# EAGLE design booster013 (EAGLE 4.16)

## Sheet 1 of 2
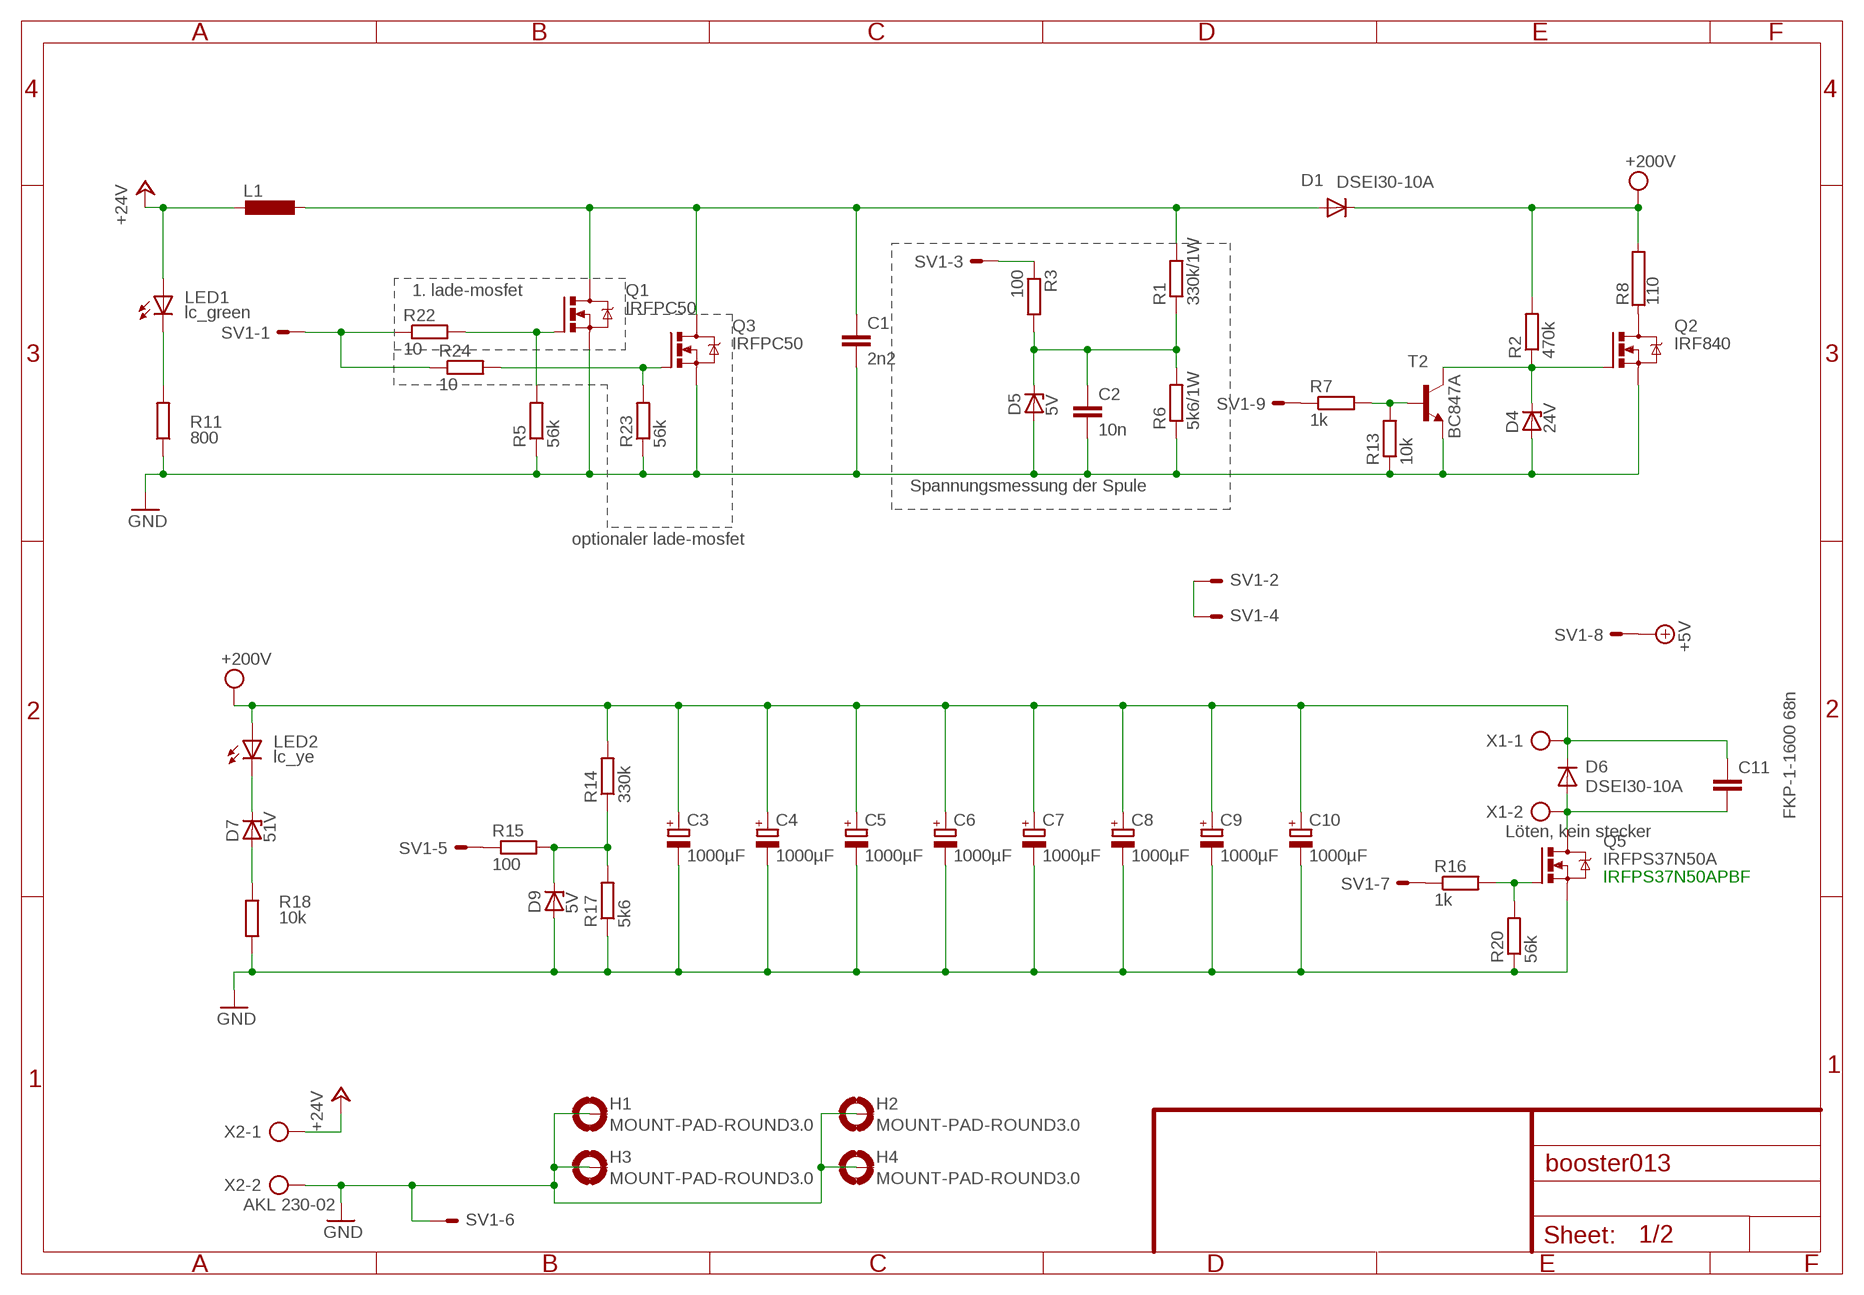
[diagram p0: schematic, sheet 1]

### Parts
C1  2n2  C-EU150-054X183  [C150-054X183]
C2  10n  C-EUC0603  [C0603]
C3  1000µF  CPOL-EUE10-35  [EB35D]
C4  1000µF  CPOL-EUE10-35  [EB35D]
C5  1000µF  CPOL-EUE10-35  [EB35D]
C6  1000µF  CPOL-EUE10-35  [EB35D]
C7  1000µF  CPOL-EUE10-35  [EB35D]
C8  1000µF  CPOL-EUE10-35  [EB35D]
C9  1000µF  CPOL-EUE10-35  [EB35D]
C10  1000µF  CPOL-EUE10-35  [EB35D]
C11  FKP-1-1600 68n  C-EU375-192X418  [C375-192X418]
D1  DSEI30-10A  DEIS10-30A  [TO247AD]
D4  24V  ZENER-DIODEDO35Z10  [DO35Z10]
D5  5V  ZENER-DIODESOT23  [SOT23]
D6  DSEI30-10A  DEIS10-30A  [TO247AD]
D7  51V  ZENER-DIODEDO35Z10  [DO35Z10]
D9  5V  ZENER-DIODESOT23  [SOT23]
H1  MOUNT-PAD-ROUND3.0  [3,0-PAD]
H2  MOUNT-PAD-ROUND3.0  [3,0-PAD]
H3  MOUNT-PAD-ROUND3.0  [3,0-PAD]
H4  MOUNT-PAD-ROUND3.0  [3,0-PAD]
L1  L-EUTJ6-U1  [TJ6-U1]
LED1  lc_green  LED5MM  [LED5MM]
LED2  lc_ye  LED5MM  [LED5MM]
Q1  IRFPC50  IRFPC40  [TO247BV]
Q2  IRF840  IRF740  [TO220BV]
Q3  IRFPC50  IRFPC40  [TO247BV]
Q5  IRFPS37N50A  IRFPC40  [TO247BV]
R1  330k/1W  R-EU_0309/12  [0309/12]
R2  470k  R-EU_R0805  [R0805]
R3  100  R-EU_R0805  [R0805]
R5  56k  R-EU_R0805  [R0805]
R6  5k6/1W  R-EU_0309/12  [0309/12]
R7  1k  R-EU_R0805  [R0805]
R8  110  RHS25  [HS25]
R11  800  R-EU_R0805  [R0805]
R13  10k  R-EU_R0805  [R0805]
R14  330k  R-EU_R0805  [R0805]
R15  100  R-EU_R0805  [R0805]
R16  1k  R-EU_R0805  [R0805]
R17  5k6  R-EU_R0805  [R0805]
R18  10k  R-EU_R0805  [R0805]
R20  56k  R-EU_R0805  [R0805]
R22  10  R-EU_R0805  [R0805]
R23  56k  R-EU_R0805  [R0805]
R24  10  R-EU_R0805  [R0805]
SV1  ML10LE  [ML10L]
T2  BC847A  BC817-25-NPN-SOT23-BEC  [SOT23-BEC]
X1  Löten, kein stecker  AK500/2-H  [AK500/2-H]
X2  AKL 230-02  AK500/2-H  [AK500/2-H]

### Nets
+5V: SV1.8 ; also sheet 2
+24V: L1.2 LED1.A X2.1
ADC_250V: C2.1 D5.3(C) R1.1 R3.2 R6.2
ADC_250V1: D9.3(C) R14.1 R15.2 R17.2
GND [Power]: C1.2 C2.2 C3.- C4.- C5.- C6.- C7.- C8.- C9.- C10.- D4.A D5.1(A) D9.1(A) H1.B3,0(MOUNT) H2.B3,0(MOUNT) H3.B3,0(MOUNT) H4.B3,0(MOUNT) Q1.S Q2.S Q3.S Q5.S R5.1 R6.1 R11.1 R13.1 R17.1 R18.1 R20.1 R23.1 SV1.6 T2.E X2.2 ; also sheet 2
N$2: Q5.G R16.2 R20.2
N$3: D7.A R18.2
N$5: C11.2 D6.A Q5.D X1.2
N$6: D7.C LED2.K(C)
N$7: LED1.K(C) R11.2
N$8: R15.1 SV1.5
N$9: R3.1 SV1.3
N$10: Q2.D R8.1
N$11: R16.1 SV1.7
N$14: R7.1 SV1.9
N$16: SV1.2 SV1.4
N$18: D4.C Q2.G R2.1 T2.C
N$20: R22.1 R24.1 SV1.1
N$21: R7.2 R13.2 T2.B
N$22: Q3.G R23.2 R24.2
N$29: Q1.G R5.2 R22.2
N$32 [Power]: C1.1 D1.A L1.1 Q1.D Q3.D R1.2
VPP: C3.+ C4.+ C5.+ C6.+ C7.+ C8.+ C9.+ C10.+ C11.1 D1.K(C) D6.K(C) LED2.A R2.2 R8.2 R14.2 X1.1 ; supply symbol labelled +200V ; also sheet 2

### Notes on the sheet
- 1. lade-mosfet
- Spannungsmessung der Spule
- optionaler lade-mosfet
- IRFPS37N50APBF

## Sheet 2 of 2
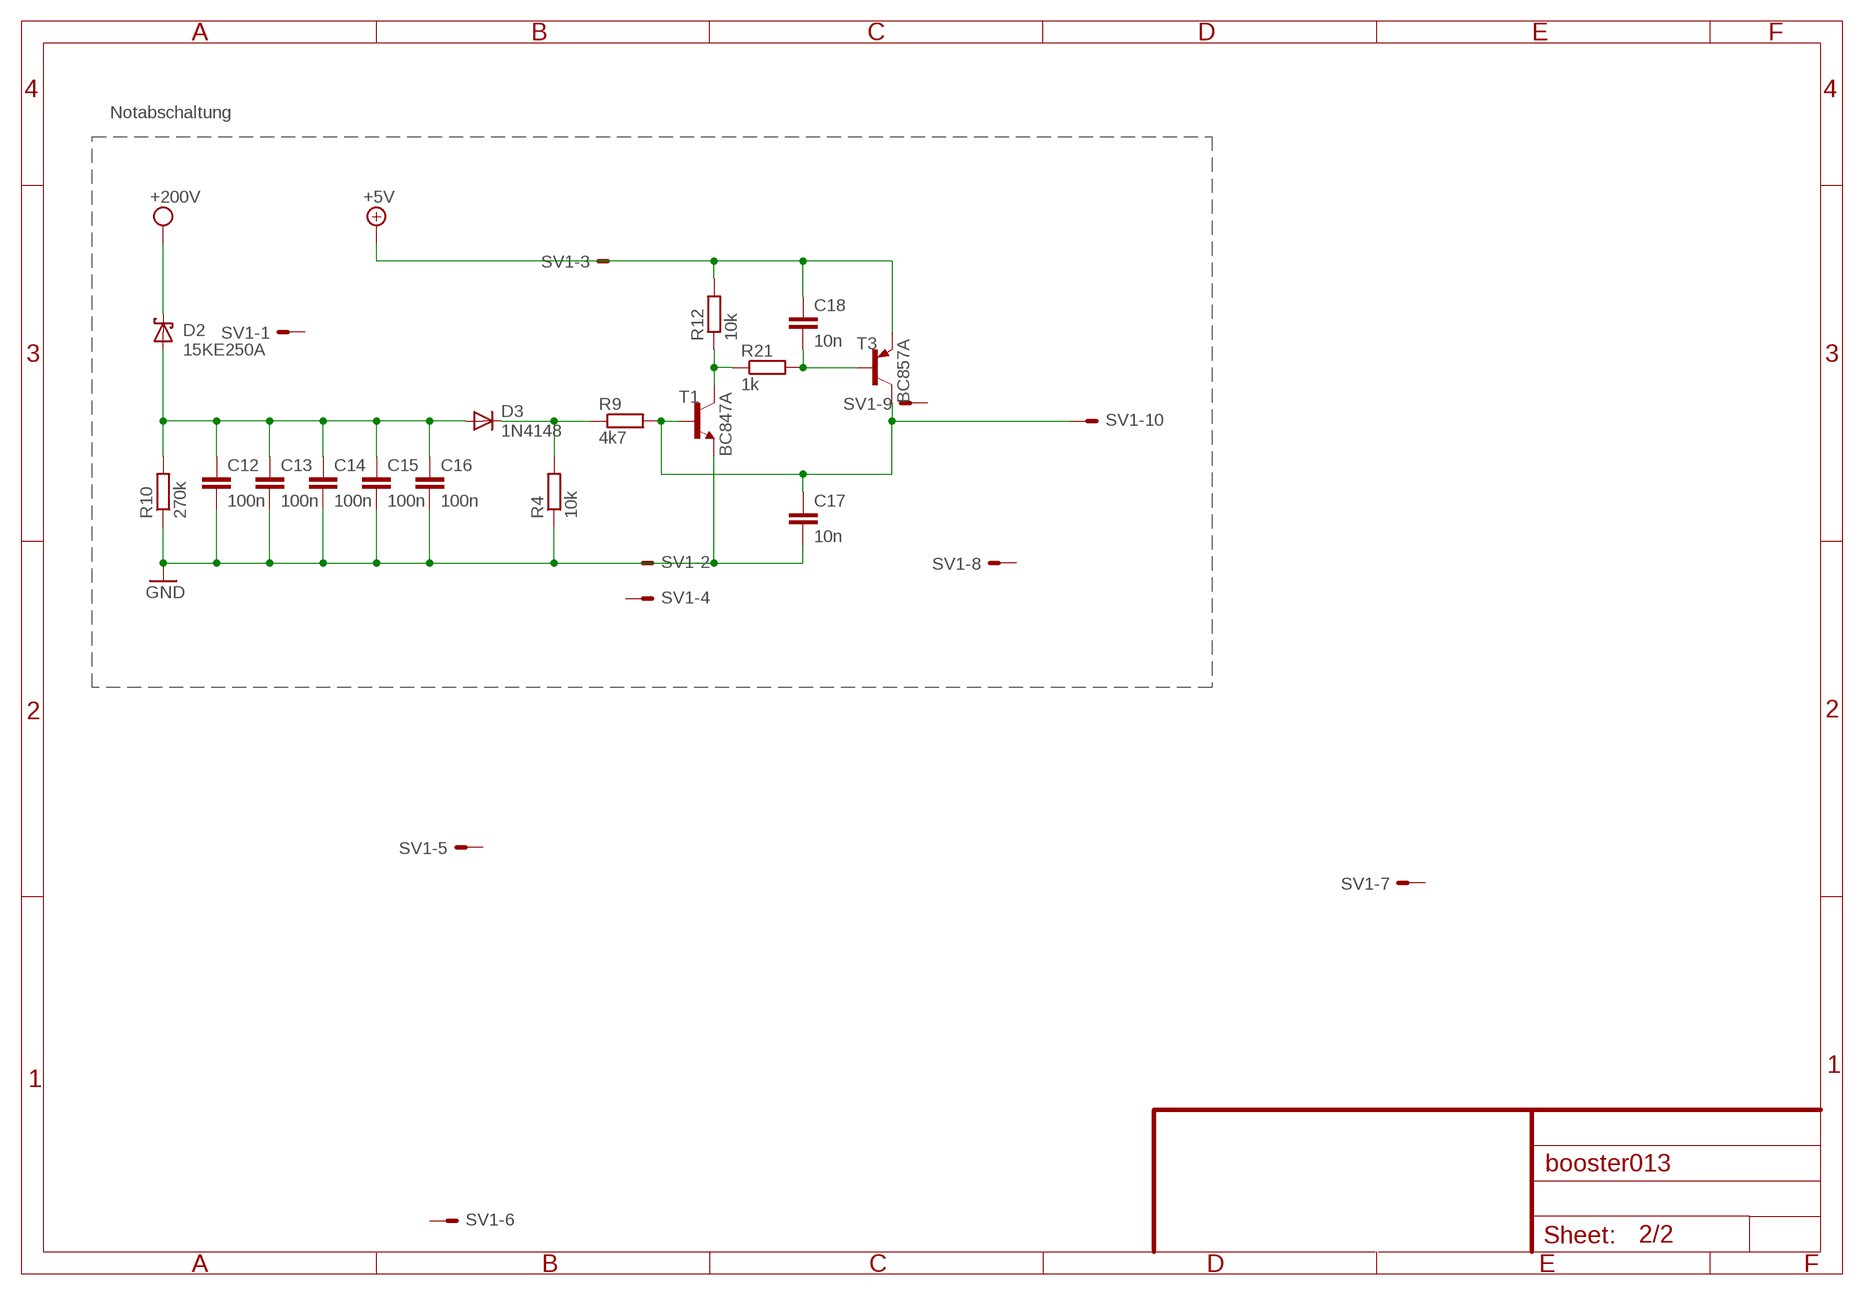
[diagram p1: schematic, sheet 2]

### Parts
C12  100n  C-EUC0603  [C0603]
C13  100n  C-EUC0603  [C0603]
C14  100n  C-EUC0603  [C0603]
C15  100n  C-EUC0603  [C0603]
C16  100n  C-EUC0603  [C0603]
C17  10n  C-EUC0603  [C0603]
C18  10n  C-EUC0603  [C0603]
D2  15KE250A  15KEXX  [CB429-17]
D3  1N4148  [DO35-10]
R4  10k  R-EU_R0805  [R0805]
R9  4k7  R-EU_R0805  [R0805]
R10  270k  R-EU_R0805  [R0805]
R12  10k  R-EU_R0805  [R0805]
R21  1k  R-EU_R0805  [R0805]
T1  BC847A  BC817-25-NPN-SOT23-BEC  [SOT23-BEC]
T3  BC857A  BC807-25-PNP-SOT23-BEC  [SOT23-BEC]

### Nets
+5V: C18.1 R12.2 T3.E ; also sheet 1
GND [Power]: C12.2 C13.2 C14.2 C15.2 C16.2 C17.2 R4.1 R10.1 T1.E ; also sheet 1
N$1: C12.1 C13.1 C14.1 C15.1 C16.1 D2.A D3.A R10.2
N$4: D3.C R4.2 R9.1
N$15: C17.1 R9.2 SV1.10 T1.B T3.C
N$17: R12.1 R21.1 T1.C
N$19: C18.2 R21.2 T3.B
VPP: D2.C ; supply symbol labelled +200V ; also sheet 1

### Notes on the sheet
- Notabschaltung

## Library data of the parts
C1 C2 C11-C18 = rcl:C-EU: CAPACITOR, European symbol
C3-C10 = rcl:CPOL-EU: POLARIZED CAPACITOR, European symbol
D1 D6 = carpenoctem:DEIS10-30A
D2 = diode:15KEXX: DIODE
D3 = diode:1N4148: DIODE high speed (Philips)
D4 D5 D7 D9 = diode:ZENER-DIODE: Z-Diode
H1-H4 = holes:MOUNT-PAD-ROUND: MOUNTING PAD, round
L1 = rcl:L-EU: INDUCTOR, European symbol
LED1 LED2 = led:LED: LED OSRAM: - CHIPLED LG R971, LG N971, LY N971, LG Q971, LY Q971, LO R971, LY R971 LH N974, LH R974 LS Q976, LO Q976, LY Q976 LO Q996 - Hyper CHIPLED LW Q18S LB Q993, LB Q99A, LB R99A - SideLED LS A670, LO A670, LY A670, LG A670, LP A670 LB A673, LV A673, LT A673, LW A673 LH A674 LY A675 LS A676, LA A676, LO A676, LY A676, LW A676 LS A679, LY A679, LG A679 - Hyper Micro SIDELED® LS Y876, LA Y876, LO Y876, LY Y876 LT Y87S - SmartLED LW L88C, LW L88S LB L89C, LB L89S, LG L890 LS L89K, LO L89K, LY L89K LS L896, LA L896, LO L896, LY L896 - TOPLED LS T670, LO T670, LY T670, LG T670, LP T670 LSG T670, LSP T670, LSY T670, LOP T670, LYG T670 LG T671, LOG T671, LSG T671 LB T673, LV T673, LT T673, LW T673 LH T674 LS T676, LA T676, LO T676, LY T676, LB T676, LH T676, LSB T676, LW T676 LB T67C, LV T67C, LT T67C, LS T67K, LO T67K, LY T67K, LW E67C LS E67B, LA E67B, LO E67B, LY E67B, LB E67C, LV E67C, LT E67C LW T67C LS T679, LY T679, LG T679 LS T770, LO T770, LY T770, LG T770, LP T770 LB T773, LV T773, LT T773, LW T773 LH T774 LS E675, LA E675, LY E675, LS T675 LS T776, LA T776, LO T776, LY T776, LB T776 LHGB T686 LT T68C, LB T68C - Hyper Mini TOPLED® LB M676 - Mini TOPLED Santana® LG M470 LS M47K, LO M47K, LY M47K Source: http://www.osram.convergy.de - LUMILED® LXK2-PW12-R00, LXK2-PW12-S00, LXK2-PW14-U00, LXK2-PW14-V00 LXK2-PM12-R00, LXK2-PM12-S00, LXK2-PM14-U00 LXK2-PE12-Q00, LXK2-PE12-R00, LXK2-PE12-S00, LXK2-PE14-T00, LXK2-PE14-U00 LXK2-PB12-K00, LXK2-PB12-L00, LXK2-PB12-M00, LXK2-PB14-N00, LXK2-PB14-P00, LXK2-PB14-Q00 LXK2-PR12-L00, LXK2-PR12-M00, LXK2-PR14-Q00, LXK2-PR14-R00 LXK2-PD12-Q00, LXK2-PD12-R00, LXK2-PD12-S00 LXK2-PH12-R00, LXK2-PH12-S00 LXK2-PL12-P00, LXK2-PL12-Q00, LXK2-PL12-R00 Source: www.luxeon.com
Q1 Q3 Q5 = transistor-power:IRFPC40: N-CHANNEL MOS FET
Q2 = transistor-power:IRF740: N-CHANNEL MOS FET
R1-R7 R9-R18 R20-R24 = rcl:R-EU_: RESISTOR, European symbol
R8 = resistor-power:R: Power Resitor
SV1 = con-harting-ml:ML10?E: HARTING
T1 T2 = transistor:*-NPN-: NPN Transistror
T3 = transistor:*-PNP-: PNP Transistror
X1 X2 = con-ptr500:AK500/2-H: CONNECTOR Aug. 2004 / PTR Meßtechnik: Die Bezeichnung der Serie AK505 wurde geändert. Es handelt sich hierbei um AK500 in horizontaler Ausführung.

## Net classes
1 Power: width 0.406 mm
2 High Power: width 2 mm

## Board
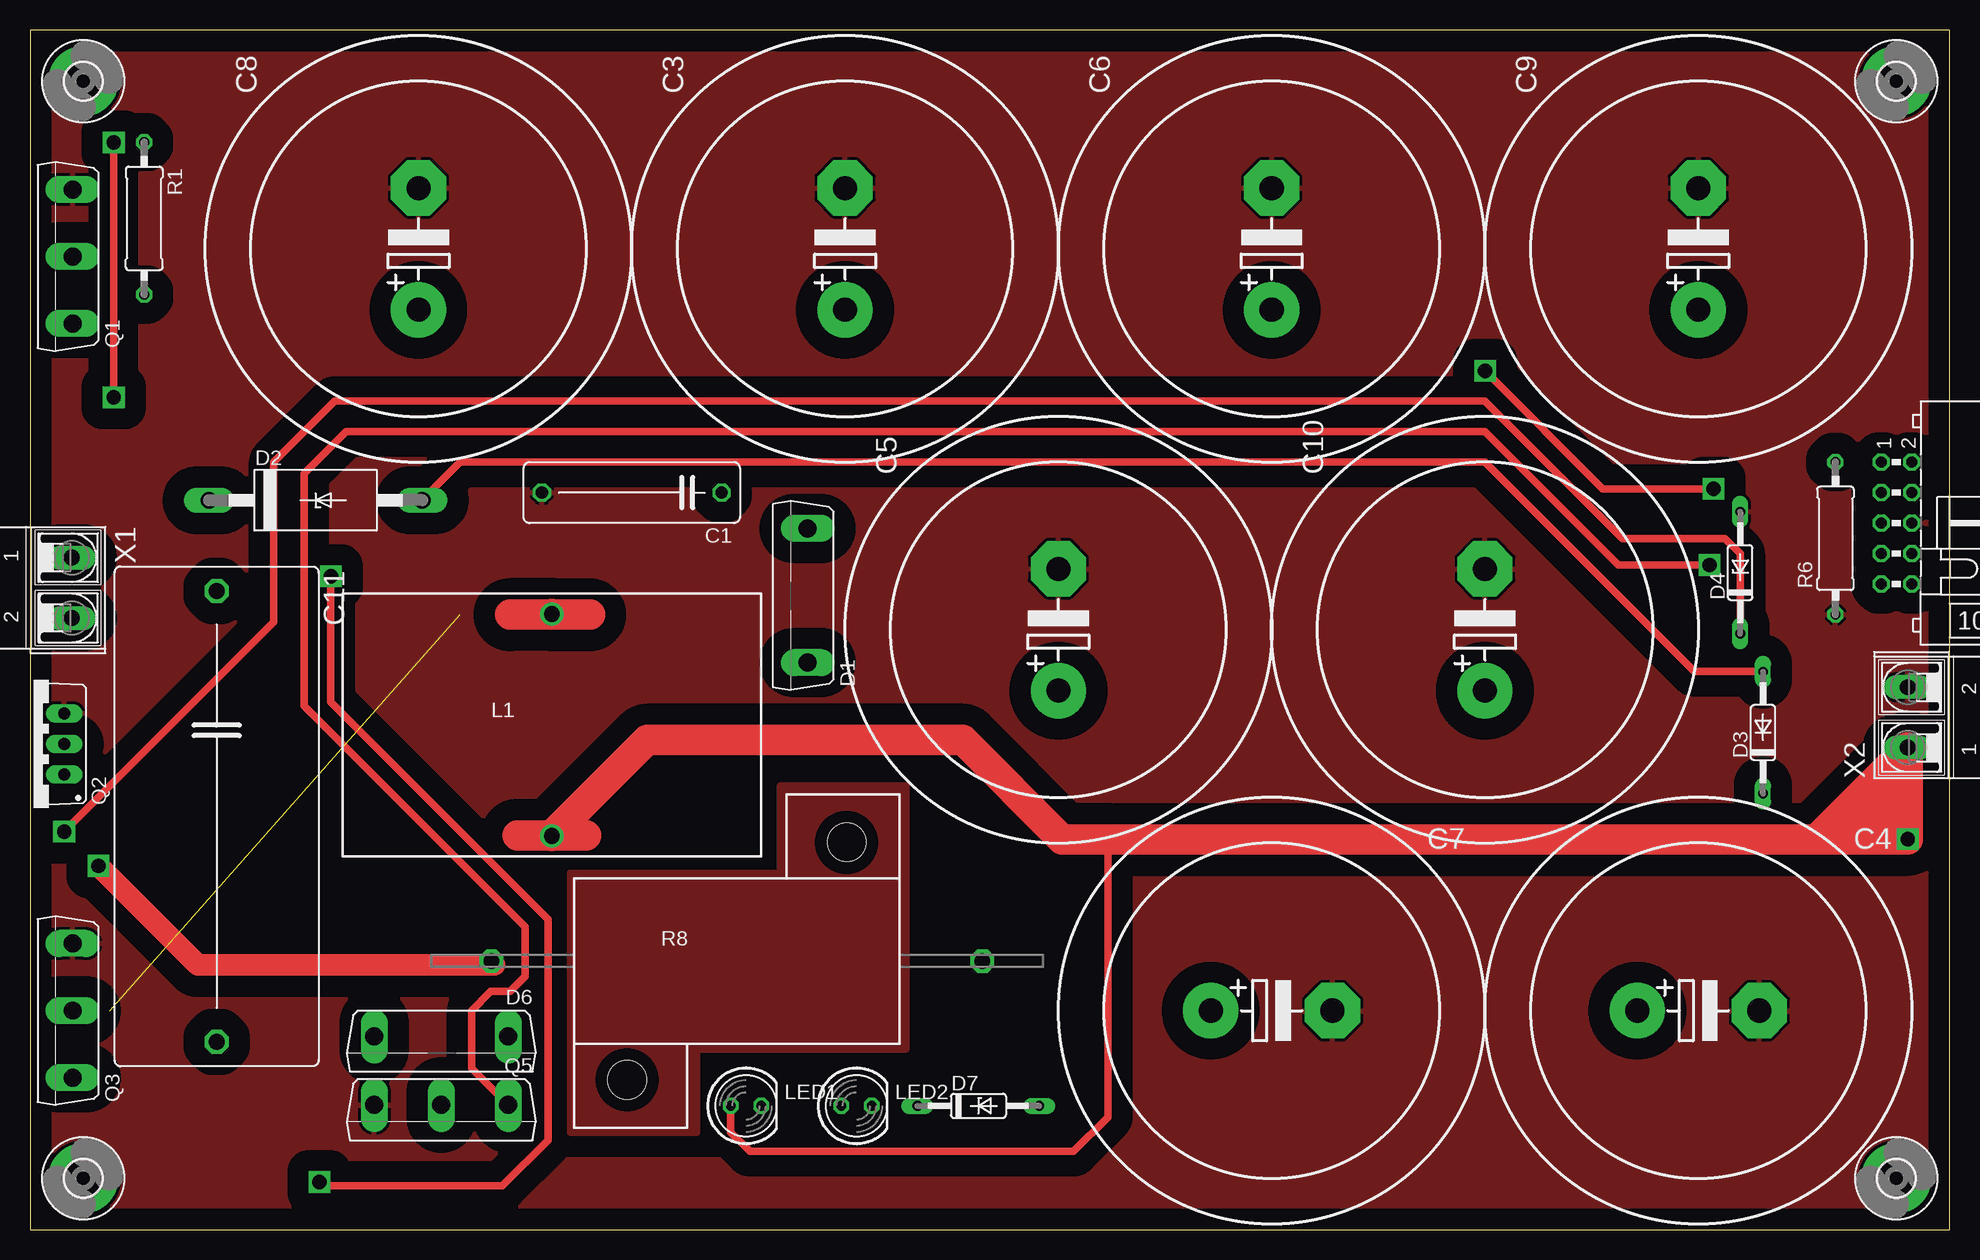
[diagram p2: board, top side]
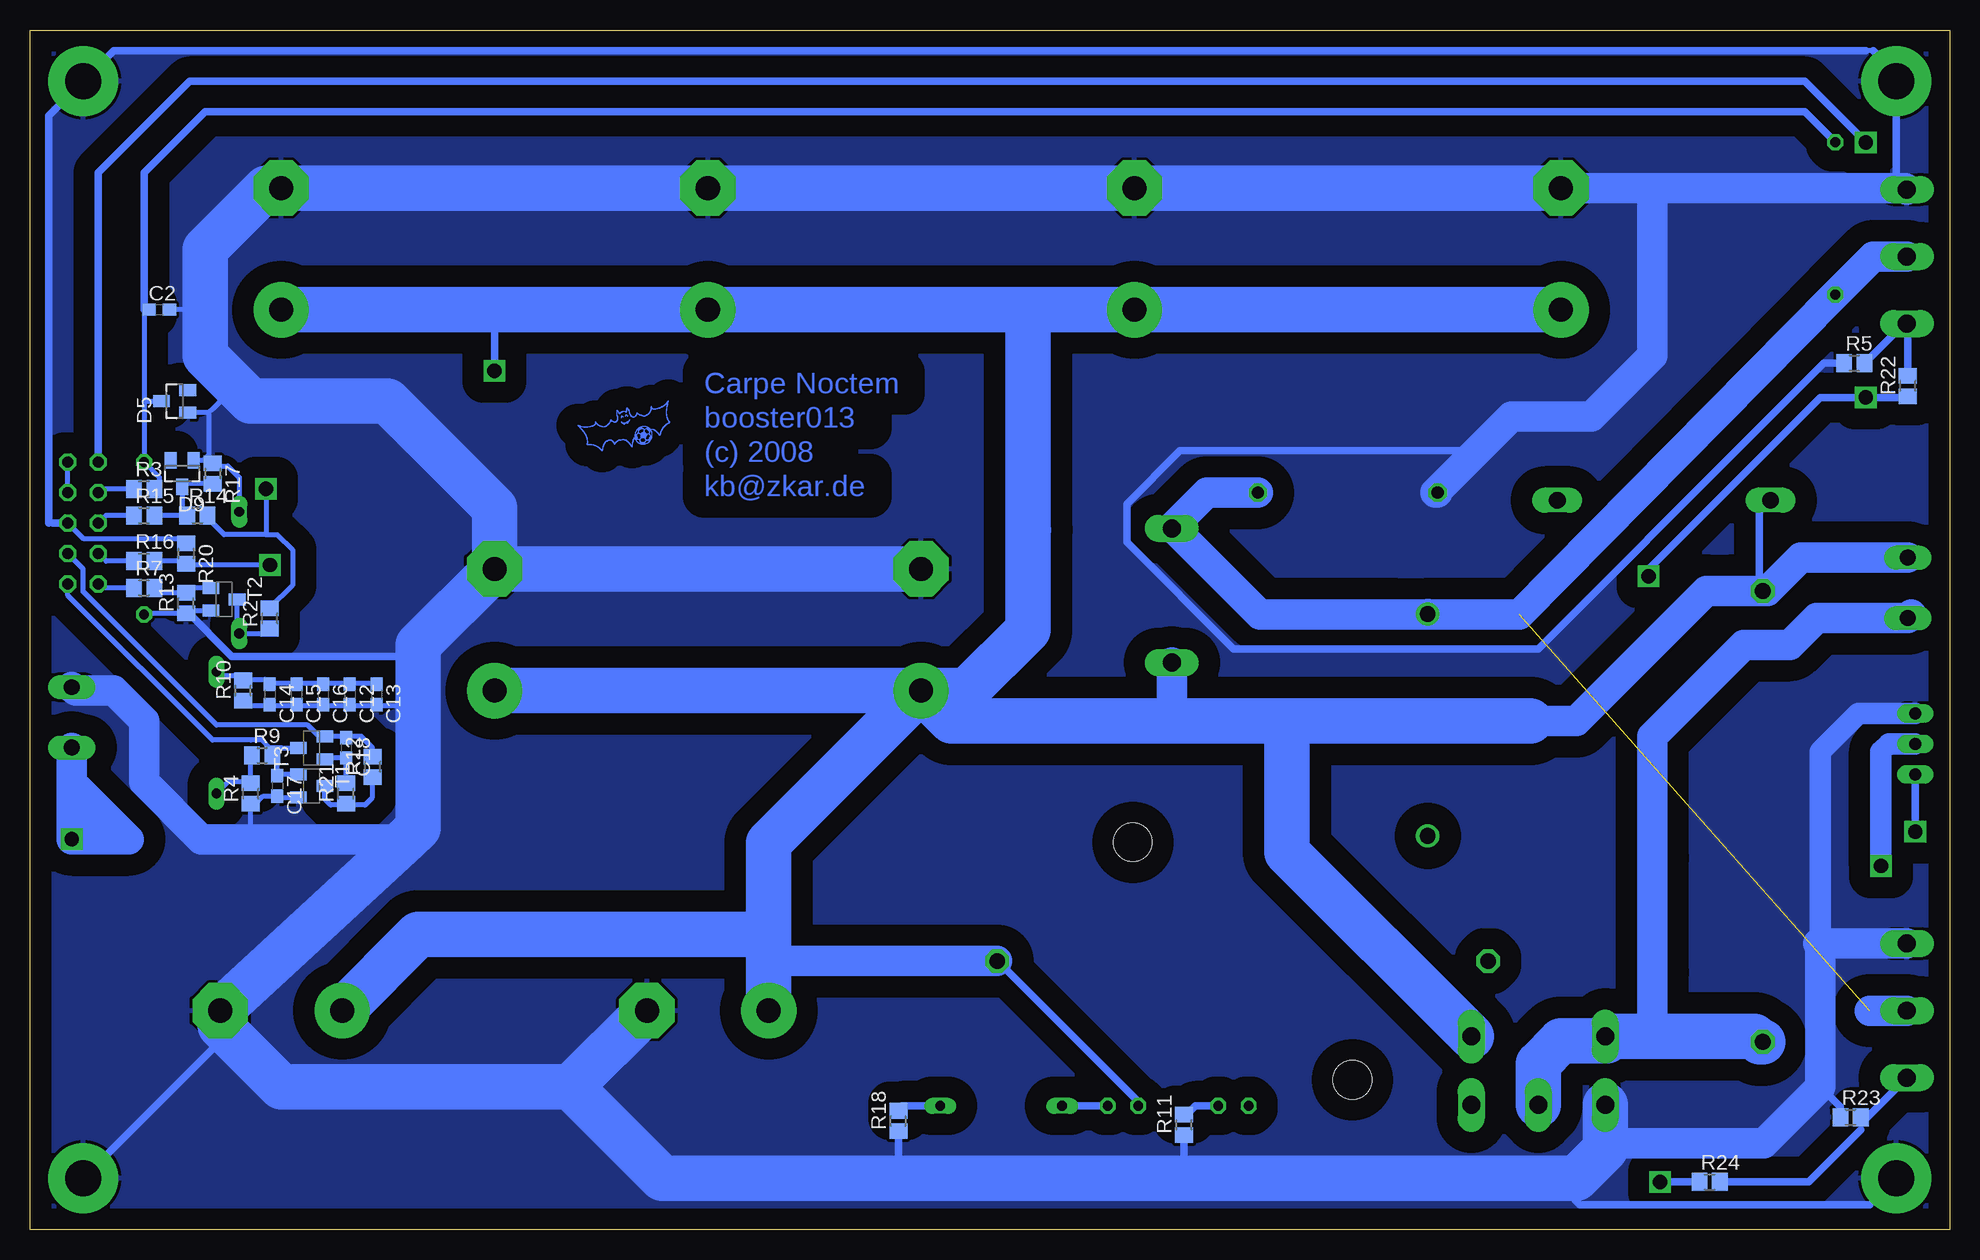
[diagram p3: board, bottom side, seen from below]

Size 160 x 100 mm. Coordinates in mm from the lower left corner, seen from the top.
Outline: 0,0 160,0 160,100 0,100 0,0
Copper layers (1*16): Top 0.035mm / dielectric 1.5mm / Bottom 0.035mm
Design rules "10mils": minimum track width 10mil, minimum drill 24mil, track to track 10mil, track to pad 10mil, pad to pad 10mil, via to via 10mil, smd to smd 10mil, copper to edge 40mil, drill to drill 10mil, minimum pad ring 10mil, minimum via ring 8mil, stop-mask expansion 0mil, vias tented up to drill 0mil, thermal gap 10mil

### Footprints (pad centres in the part's own frame; a part is rotated, then mirrored left to right if it is on the bottom)
C150-054X183 = drill 1.016 octagon: 1 -7.493,0; 2 7.493,0
C0603 = smd 1.1 x 1: 1 -0.85,0; 2 0.85,0
EB35D = drill 2.007 pad 4.597 round: + -5.08,0 | drill 2.007 pad 4.597 octagon: - 5.08,0
C375-192X418 = drill 1.321 octagon: 1 -18.796,0; 2 18.796,0
TO247AD = drill 1.499 long: A 5.588,-0.381; K -5.588,-0.381
CB429-17 = drill 1.397 long: A 8.89,0; C -8.89,0
DO35-10 = drill 0.813 long: A 5.08,0; C -5.08,0
DO35Z10 = drill 0.813 long: A 5.08,0; C -5.08,0
SOT23 = smd 1 x 1.4: 1 -0.95,-1.1; 2 0.95,-1.1; 3 0,1.1
3,0-PAD = drill 3 pad 5.842 round: B3,0 0,0
TJ6-U1 = drill 1.3 round: 1 -9.25,0; 2 9.25,0
LED5MM = drill 0.813 octagon: A -1.27,0; K 1.27,0
TO247BV = drill 1.499 long: D 0,-2.921; G -5.588,-2.921; S 5.588,-2.921
TO220BV = drill 1.016 long: D 0,-2.54; G -2.54,-2.54; S 2.54,-2.54
0309/12 = drill 0.813 octagon: 1 -6.35,0; 2 6.35,0
R0805 = smd 1.3 x 1.5: 1 -0.85,0; 2 0.85,0
HS25 = drill 1.3 octagon: 1 -20.47,0; 2 20.47,0 | hole 3.2: 9.15,9.9; -9.15,-9.9
ML10L = drill 0.914 octagon: 1 -5.08,-1.27; 2 -5.08,1.27; 3 -2.54,-1.27; 4 -2.54,1.27; 5 0,-1.27; 6 0,1.27; 7 2.54,-1.27; 8 2.54,1.27; 9 5.08,-1.27; 10 5.08,1.27
SOT23-BEC = smd 1 x 1.4: B -0.95,-1.1; C 0,1.1; E 0.95,-1.1
AK500/2-H = drill 1.321 long: 1 -2.515,0; 2 2.515,0

### Placement (x,y rotation side)
C1  50.16,61.43 180 top
C2  149.22,76.67 0 bottom
C3  67.94,81.75 90 top
C4  139.06,18.25 0 top
C5  85.72,50 90 top
C6  103.5,81.75 90 top
C7  103.5,18.25 0 top
C8  32.38,81.75 90 top
C9  139.06,81.75 90 top
C10  121.28,50 90 top
C11  15.55,34.44 270 top
C12  133.34,44.6 270 bottom
C13  131.12,44.6 270 bottom
C14  140.01,44.6 270 bottom
C15  137.79,44.6 270 bottom
C16  135.57,44.6 270 bottom
C17  139.38,36.98 270 bottom
C18  133.66,40.16 270 bottom
D1  64.45,52.86 90 top
D2  23.81,60.8 0 top
D3  144.46,41.43 90 top
D4  142.55,54.76 90 top
D5  147.95,69.05 90 bottom
D6  34.29,15.71 180 top
D7  79.05,10.31 0 top
D9  147.31,63.02 180 bottom
H1  4.44,95.72 0 top
H2  155.57,95.72 0 top
H3  4.44,4.28 0 top
H4  155.57,4.28 0 top
L1  43.49,42.06 270 top
LED1  59.69,10.31 0 top
LED2  68.89,10.31 0 top
Q1  0.63,81.11 90 top
Q2  0.31,40.48 90 top
Q3  0.63,18.25 90 top
Q5  34.29,7.46 180 top
R1  9.52,84.29 270 top
R2  140.01,50.95 90 bottom
R3  150.49,61.75 0 bottom
R4  141.6,36.35 90 bottom
R5  7.93,72.22 0 bottom
R6  150.49,57.62 90 top
R7  150.49,53.49 0 bottom
R8  58.92,22.38 0 top
R9  140.65,39.52 0 bottom
R10  142.23,44.92 90 bottom
R11  63.81,8.73 90 bottom
R12  131.44,38.57 90 bottom
R13  147,52.22 90 bottom
R14  146.04,59.52 0 bottom
R15  150.49,59.52 0 bottom
R16  150.49,55.71 0 bottom
R17  144.78,63.02 270 bottom
R18  87.62,9.04 90 bottom
R20  147,56.35 270 bottom
R21  133.66,36.35 90 bottom
R22  3.49,70.32 90 bottom
R23  8.25,9.36 0 bottom
R24  20,3.96 0 bottom
SV1  155.57,58.89 270 top
T1  136.52,36.98 270 bottom
T2  143.82,52.54 270 bottom
T3  136.52,40.16 90 bottom
U$1  [CN-LOGO-WIRE]  110.17,66.83 0 bottom
X1  3.49,53.49 270 top
X2  156.52,42.7 90 top

### Tracks (layer width: path | path; a pad name or v marks a point on that pad's centre or on a via)
+5V
  Bottom 0.406: SV1.8 155.57,55.08 155.57,53.17 144.46,42.06 136.84,42.06 135.88,41.11 T3.E 133.98,41.11 133.66,40.79 C18.1 133.66,41.11 132.39,41.11 131.44,40.16 R12.2
+24V  (via drill 1.2 pad 1.78)
  Top 0.61: LED1.A 58.41,8.09 60,6.5 86.99,6.5 89.85,9.36 89.85,32.54
  Top 2.54: 43.49,32.85 L1.2 | 156.52,40.16 X2.1 | 156.52,40.16 148.93,32.56 | 156.52,40.16 v156.52,32.54 151.44,32.54 | 149.22,32.54 148.9,32.54 | 149.22,32.54 151.44,32.54 | 151.44,32.54 154.94,36.03 154.94,34.44 154.62,34.12 | 43.49,32.85 40.64,32.85 | 43.49,32.85 46.35,32.85 | 43.49,32.85 51.43,40.79 77.78,40.79 86.04,32.54 89.85,32.54 149.22,32.54
  Bottom 2.54: 156.52,36.66 156.52,40.16 | 156.52,36.66 v156.52,32.54 151.76,32.54 155.89,36.66 156.52,36.66 | 156.52,36.66 154.94,35.08 154.94,34.12
ADC_250V
  Bottom 0.406: 150.49,69.05 150.49,76.67 C2.1 | R3.2 149.22,61.43 149.22,62.7 R6.2 150.49,69.05 | 150.49,69.05 D5.3
  Bottom 0.61: R1.1 12.06,93.18 145.41,93.18 150.49,88.1 150.49,76.67
ADC_250V1
  Bottom 0.406: R17.2 147.21,62.17 147.31,62.06 D9.3 147.31,61.75 147.31,59.95 R14.1 147.31,59.52 R15.2
GND
  Bottom 0.406: 144.14,16.98 142.87,16.98 | 140.33,69.05 140.75,68.63 | 145.41,76.67 C2.2 | 9.1,10.21 R23.1 | 145.09,68.1 D5.1 | 142.87,70.32 144.78,68.41 145.09,68.1 | 145.41,64.12 144.94,64.12 144.78,64.29 R17.1 144.88,63.87 145.09,63.65 143.5,63.65 142.55,62.7 142.55,60.16 D4.A | 145.41,64.12 D9.1 | 158.43,58.89 158.11,58.89 | Q1.S 3.68,86.7 3.8,86.83 4.44,87.47 | 6.34,98.26 6.98,98.26 | H1.B3,0 4.44,96.36 | 141.6,32.54 141.6,32.85 R4.1 141.38,35.5 141.28,35.39 140.54,36.13 C17.2 139.38,36.03 T1.E | 145.41,64.12 145.41,64.29 145.09,64.61 145.09,68.1 | 140.01,43.65 C14.2 | R10.1 141.81,43.65 140.01,43.65 | 140.01,43.65 137.79,43.65 C15.2 137.69,43.65 135.57,43.65 C16.2 135.47,43.65 133.34,43.65 C12.2 133.24,43.65 131.12,43.65 | 131.12,43.65 C13.2 | C13.2 131.02,43.65 | 87.94,4.28 87.94,4.6 87.62,4.92 | 144.78,51.59 T2.E 147,51.59 147,51.27 R13.1 150.07,51.37 150.17,51.27 R6.1 | R20.1 147.42,57.62 155.57,57.62 SV1.6 | H3.B3,0 6.66,2.06 | 31.74,3.01 31.74,4.28 | 39.68,64.61 39.37,64.29 40,64.92 | 128.27,47.78 127.95,47.78 127.63,47.46 | 127.63,43.65 131.12,43.65 | 131.12,43.65 C13.2 | 8.89,72.22 R5.1
  Bottom 0.61: 6.98,98.26 153.03,98.26 H2.B3,0 158.43,92.86 158.43,64.29 158.43,60.48 158.43,58.89 | 142.87,16.98 H4.B3,0 | 10.79,11.9 9.1,10.21 | 158.11,58.89 SV1.6 | 4.44,87.47 H1.B3,0 | 4.44,96.36 6.34,98.26 | 63.81,4.28 R11.1 | 87.62,4.92 R18.1 | 147,51.59 143.18,47.78 128.27,47.78 | 6.66,2.06 30.79,2.06 31.74,3.01 | 40,64.92 64.13,64.92 68.57,60.48 68.57,57.3 59.69,48.41 34.29,48.41 16.09,66.61 10.47,72.22 8.89,72.22
  Bottom 1.778: Q2.S 7.62,43.02 10.79,39.84 10.79,23.65
  Bottom 2.54: Q1.S 3.68,86.83 3.8,86.83 17.14,86.83 24.76,86.83 | C8.- 24.76,86.83 | 24.76,86.83 24.76,72.86 29.84,67.78 36.51,67.78 39.68,64.61 42.86,61.43 C1.2 | 28.7,7.46 28.57,7.46 28.32,7.2 15.49,7.2 13.33,9.36 10.79,11.9 10.79,23.65 10.47,23.96 10.92,23.84 Q3.S | 128.62,32.58 128.58,32.54 141.6,32.54 145.73,32.54 150.49,37.3 150.49,42.38 153.03,44.92 156.2,44.92 156.52,45.24 X2.2
  Bottom 3.81: 114.93,11.9 C7.- | 114.93,11.9 139.06,11.9 144.14,16.98 C4.- 128.62,32.58 127.63,33.49 127.63,43.65 127.63,47.46 127.63,48.73 C10.- | C8.- C3.- C6.- C9.- 140.33,86.83 145.41,81.75 145.41,76.67 145.41,72.86 142.87,70.32 141.6,69.05 140.33,69.05 139.06,69.05 130.17,69.05 121.28,60.16 C10.- | C10.- C5.- | Q5.S 28.7,7.46 28.7,6.69 31.11,4.28 31.74,4.28 63.81,4.28 87.94,4.28 107.31,4.28 114.93,11.9
  pour Bottom (isolate 1.778): 160.33,100.16 -0.32,100.16 -0.32,-0.48 160.33,-0.17
  pour Top (isolate 1.778, rank 2): -0.32,100.16 160.33,100.16 160.33,-0.17 -0.32,-0.48
N$1
  Top 0.406: D3.A 144.14,46.19
  Top 0.61: D2.A 35.87,63.97 121.28,63.97 138.74,46.51 D3.A
  Bottom 0.406: C13.1 131.22,45.55 133.34,45.55 C12.1 133.45,45.55 135.57,45.55 C16.1 135.67,45.55 137.79,45.55 C15.1 137.89,45.55 140.01,45.55 C14.1 140.43,45.87 142.23,45.87 | 142.23,45.87 R10.2 | D3.A 144.46,46.19 142.55,46.19 142.23,45.87
N$2  (via drill 1.2 pad 1.78)
  Top 0.61: v140.01,55.4 132.39,55.4 121.28,66.51 26.35,66.51 22.86,63.02 22.86,43.65 41.11,25.39 41.27,25.23 41.27,21.11 40,19.84 38.41,19.84 36.83,18.25 36.83,13.42 Q5.G
  Bottom 0.406: R16.2 147.31,55.71 147.1,55.5 R20.2 146.89,55.4 v140.01,55.4
N$3
  Bottom 0.406: R18.2 87.62,10 87.31,10.31
  Bottom 0.61: D7.A 87.31,10.31
N$4
  Bottom 0.406: R9.1 141.5,39.31 141.6,39.2 141.6,37.3 | 141.6,37.3 R4.2 141.6,37.3 | 141.6,37.3 143.19,37.3 143.5,37.3 D3.C
N$5
  Bottom 2.54: 3.46,50.98 3.17,51.27 | 3.46,50.98 X1.2 | 3.46,50.98 11.08,50.98 13.33,48.73 17.14,48.73 24.76,41.11 24.76,30.95 24.76,21.42 24.76,15.71 24.76,16.09
  Bottom 3.81: Q5.D 34.29,13.81 32.38,15.71 28.57,15.71 28.7,15.84 D6.A 24.76,16.09 16.25,16.09 15.87,15.71 15.81,15.65 C11.2
N$6
  Bottom 0.406: D7.C 73.97,10 73.66,10.31
  Bottom 0.61: LED2.K 73.66,10.31
N$7
  Bottom 0.406: 63.5,9.68 63.6,9.58 R11.2
  Bottom 0.61: LED1.K 62.86,10.31 63.5,9.68
N$8
  Bottom 0.406: R15.1 153.66,59.52 SV1.5
N$9
  Bottom 0.406: R3.1 153.98,61.75 SV1.3
N$10  (via drill 1.2 pad 1.78)
  Top 1.778: R8.1 38.45,22.34 38.73,22.06 13.97,22.06 v5.71,30.31
  Bottom 1.778: v5.71,30.31 5.71,39.84 5.08,40.48 Q2.D
N$11
  Bottom 0.406: R16.1 153.66,55.71 SV1.7
N$12
  pour Top: 45.08,29.68 45.08,8.09 55.56,8.09 55.56,15.08 73.02,15.08 73.02,36.98 62.54,36.98 62.54,29.68
N$14
  Bottom 0.406: R7.1 153.98,53.49 SV1.9
N$15
  Bottom 0.406: 139.69,39.52 R9.2 139.69,39.52 | 139.38,37.94 C17.1 139.38,37.94 | 139.38,37.94 139.38,39.2 139.69,39.52 | 139.06,40.16 T3.C | 139.69,39.52 139.06,40.16 | T1.B 139.38,37.93 139.38,37.94 | 139.06,40.16 140.01,40.16 140.65,40.79 141.6,40.79 144.78,40.79 156.84,52.86 SV1.10
N$16
  Bottom 0.406: SV1.4 SV1.2
N$17
  Bottom 0.406: R12.1 131.44,36.03 132.07,35.39 133.66,35.39 | 133.66,35.39 R21.1 133.66,35.39 | T1.C 135.42,35.88 134.93,35.39 133.66,35.39
N$18  (via drill 1.2 pad 1.78)
  Top 0.61: v2.85,33.17 20.31,50.63 20.31,63.97 25.39,69.05 121.28,69.05 132.71,57.62 141.28,57.62 142.55,56.35 D4.C
  Bottom 0.406: T2.C 142.72,49.85 D4.C 140.43,49.68 R2.1
  Bottom 0.61: v2.85,33.17 Q2.G
N$19
  Bottom 0.406: T3.B 135.56,39.21 135.57,39.2 135.47,39.31 C18.2 133.66,39.2 R21.2
N$20  (via drill 1.2 pad 1.78)
  Top 0.406: v24.12,3.96 24.12,3.64
  Top 0.61: v6.98,69.37 v6.98,90.64 | 24.12,3.64 39.37,3.64 43.18,7.46 43.18,25.87 25.08,43.97 v25.08,54.45
  Bottom 0.406: 3.59,69.37 R22.1
  Bottom 0.61: v6.98,90.64 12.06,95.72 146.68,95.72 154.3,88.1 SV1.1 | R24.1 v24.12,3.96 | v25.08,54.45 25.08,55.08 10.79,69.37 v6.98,69.37 3.59,69.37
N$21
  Bottom 0.406: T2.B 146.68,53.49 147,53.17 R13.2 149.12,53.07 149.54,53.49 R7.2
N$22
  Bottom 0.406: 6.85,9.36 7.3,9.36 R23.2 7.4,8.3 | 19.36,3.96 R24.2
  Bottom 0.61: 6.85,9.36 Q3.G | 7.4,8.3 11.74,3.96 19.36,3.96
N$29
  Bottom 0.406: 3.49,75.4 3.49,75.46 | 3.49,75.46 Q1.G 3.49,75.46 | 3.49,75.4 3.91,75.4 | 3.49,75.4 3.49,75.46
  Bottom 0.61: 3.91,75.4 R5.2 | R22.2 3.49,75.4
N$32  (1 unrouted)
  Top 2.54: 43.49,51.27 40,51.27 | L1.1 43.49,51.27 | 43.49,51.27 46.67,51.27
  Bottom 0.61: 43.49,51.27 46.03,51.27
  Bottom 2.54: 64.77,58.57 64.83,58.51 D1.A | C1.1 61.91,61.43 64.77,58.57 | 43.49,51.27 35.87,51.27 R1.2 6.34,81.11 Q1.D | Q3.D 6.66,18.25 | 64.77,58.57 57.46,51.27 46.03,51.27 43.54,51.27 L1.1
VPP  (via drill 1.2 pad 1.78)
  Top 0.61: v140.33,61.75 131.12,61.75 v121.28,71.59
  Bottom 0.406: 18.09,53.24 18.09,53.17 | R8.2 79.37,22.38 | 67.62,10.63 LED2.A | R14.2 145.19,59.31 143.82,57.94 140.33,57.94 | R2.2 138.11,53.71 138.11,56.67 139.38,57.94 140.33,57.94 | v140.33,61.75 140.33,57.94 | 15.87,53.17 15.62,53.17 C11.1 | 15.87,60.48 D2.C
  Bottom 0.61: 79.37,22.38 67.62,10.63 | 15.87,53.17 15.87,60.48 | 121.28,76.67 v121.28,71.59
  Bottom 2.54: R8.2 98.42,22.38 98.42,23.33 | X1.1 12.4,56.01 15.17,53.24 C11.1 18.09,53.24 20.25,53.24 31.11,42.38 34.92,42.38 | 76.83,57.62 76.13,58.32 | D1.K 64.83,42.44 64.77,42.38
  Bottom 3.81: 98.42,24.6 98.42,32.22 C5.+ | 98.42,24.6 98.42,23.33 C7.+ | C4.+ 127.63,24.6 98.42,24.6 | C8.+ C3.+ 76.83,76.67 | 76.83,76.67 C6.+ 121.28,76.67 C9.+ | C5.+ C10.+ | C5.+ 81.91,44.92 76.83,50 76.83,57.62 76.83,76.67 | 55.24,42.38 34.92,42.38 | 55.24,42.38 64.77,42.38 83.18,42.38 C5.+ | D6.K 55.24,31.46 55.24,42.38

### Text on the board
Bottom: Carpe Noctem | (c) 2008 | kb@zkar.de